# EAGLE design espower (EAGLE 7.3.0)
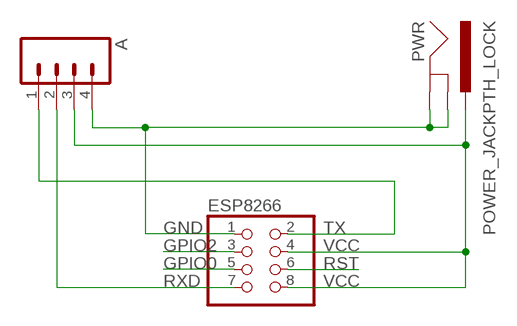
[diagram p0: schematic, sheet 1]

## Parts
A  M04PTH  [1X04]
ESP8266  PINHD-2X4  [2X04]
PWR  POWER_JACKPTH_LOCK  [POWER_JACK_PTH_LOCK]

## Nets
GND: A.4 ESP8266.1 PWR.GND PWR.GNDBREAK
GPIO0: ESP8266.5
GPIO2: ESP8266.3
RST: ESP8266.6
RXD: A.2 ESP8266.7
TX: A.1 ESP8266.2
VCC: A.3 ESP8266.4 ESP8266.8 PWR.PWR

## Library data of the parts
A = SparkFun-Connectors:M04: Header 4 Standard 4-pin 0.1" header. Use with straight break away headers (SKU : PRT-00116), right angle break away headers (PRT-00553), swiss pins (PRT-00743), machine pins (PRT-00117), and female headers (PRT-00115). Molex polarized connector foot print use with SKU : PRT-08231 with associated crimp pins and housings. 1MM SMD Version SKU: PRT-10208
ESP8266 = pinhead:PINHD-2X4: PIN HEADER
PWR = SparkFun-Connectors:POWER_JACK: Power Jack This is the standard 5.5mm barrel jack for power. The PTH is the most common, proven, reliable, footprint. The Slot footprint only works if the mill layer is transmitted to the PCB fab house so be warned. Mating wall wart : TOL-00298 (and others); PROD_ID: CONN-08197; SF_ID: PRT-00119

## Board
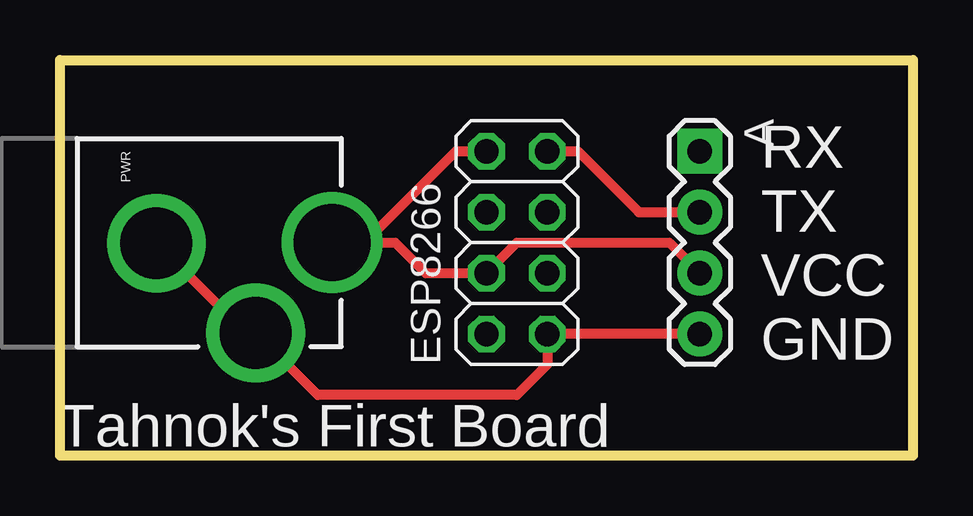
[diagram p1: board, top side]
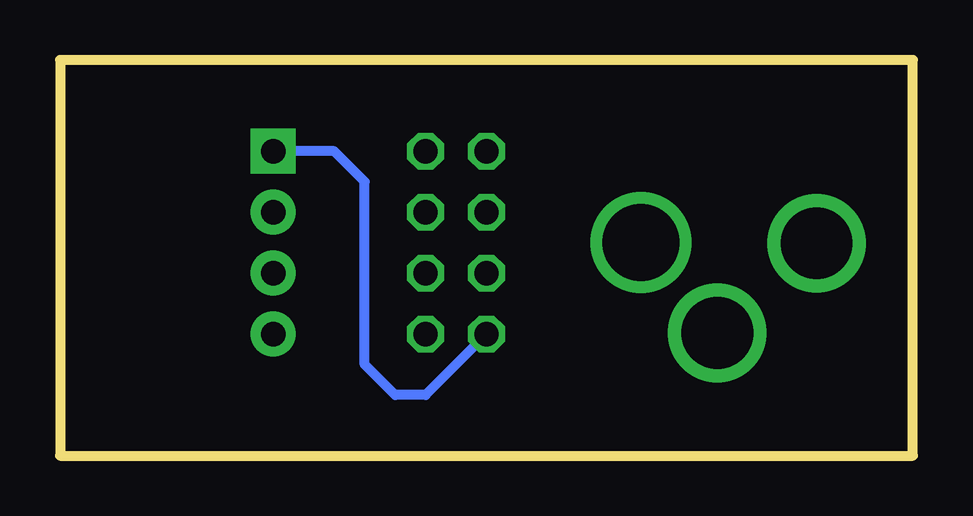
[diagram p2: board, bottom side, seen from below]

Size 35.56 x 16.51 mm. Coordinates in mm from the lower left corner, seen from the top.
Outline: 0,0 0,16.51 35.56,16.51 35.56,0 0,0
Copper layers (1*16): Top 0.035mm / dielectric 1.5mm / Bottom 0.035mm
Design rules "default": minimum track width 10mil, minimum drill 24mil, track to track 8mil, track to pad 8mil, pad to pad 8mil, via to via 8mil, smd to smd 8mil, copper to edge 40mil, drill to drill 8mil, minimum pad ring 10mil, minimum via ring 8mil, stop-mask expansion 4mil, vias tented up to drill 0mil, thermal gap 10mil

### Footprints (pad centres in the part's own frame; a part is rotated, then mirrored left to right if it is on the bottom)
1X04 = drill 1.016 pad 1.88 square: 1 0,0 | drill 1.016 pad 1.88: 2 2.54,0; 3 5.08,0; 4 7.62,0
2X04 = drill 1.016 octagon: 1 -3.81,-1.27; 2 -3.81,1.27; 3 -1.27,-1.27; 4 -1.27,1.27; 5 1.27,-1.27; 6 1.27,1.27; 7 3.81,-1.27; 8 3.81,1.27
POWER_JACK_PTH_LOCK = drill 2.997 pad 4.115: GND 0.025,6.557; GNDBREAK 3.762,10.7 | drill 3.2 pad 4.115: PWR 0,13.878

### Placement (x,y rotation side)
A  26.67,12.7 270 top
ESP8266  19.05,8.89 90 top
PWR  -2.54,8.89 270 top

### Tracks (layer width: path | path; a pad name or v marks a point on that pad's centre or on a via)
GND
  Top 0.406: A.4 ESP8266.1 20.32,3.81 19.05,2.54 10.75,2.54 PWR.GNDBREAK 7.75,5.13 PWR.GND
RXD
  Top 0.406: ESP8266.7 21.59,12.7 24.13,10.16 A.2
TX
  Bottom 0.406: ESP8266.2 20.32,2.54 21.59,2.54 22.86,3.81 22.86,11.43 24.13,12.7 A.1
VCC
  Top 0.406: ESP8266.8 16.51,12.7 12.7,8.89 PWR.PWR 13.97,8.89 15.24,7.62 ESP8266.4 19.05,8.89 25.4,8.89 A.3

### Text on the board
tPlace: RX / TX / VCC / GND | Tahnok's First Board